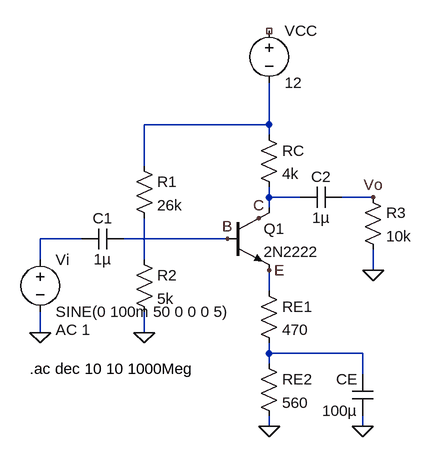
[diagram p0: schematic Draft1.asc]
Draft1.asc, the LTspice schematic file:
Version 4
SHEET 1 880 740
WIRE 352 -32 352 -96
WIRE 352 -32 160 -32
WIRE 352 -16 352 -32
WIRE 160 32 160 -32
WIRE 352 80 352 64
WIRE 400 80 352 80
WIRE 512 80 464 80
WIRE 352 96 352 80
WIRE 64 144 0 144
WIRE 288 144 128 144
WIRE 0 176 0 144
WIRE 160 176 160 112
WIRE 512 192 512 160
WIRE 352 224 352 192
WIRE 0 288 0 256
WIRE 160 288 160 256
WIRE 352 320 352 304
WIRE 496 320 352 320
WIRE 352 336 352 320
WIRE 496 352 496 320
WIRE 352 432 352 416
WIRE 496 432 496 416
FLAG 0 288 0
FLAG 160 288 0
FLAG 352 432 0
FLAG 496 432 0
FLAG 512 192 0
FLAG 512 80 Vo
FLAG 288 144 B
FLAG 352 192 E
FLAG 336 112 C
SYMBOL cap 128 128 R90
WINDOW 0 0 32 VBottom 2
WINDOW 3 32 32 VTop 2
SYMATTR InstName C1
SYMATTR Value 1µ
SYMBOL res 144 16 R0
SYMATTR InstName R1
SYMATTR Value 26k
SYMBOL res 144 160 R0
SYMATTR InstName R2
SYMATTR Value 5k
SYMBOL voltage 0 160 R0
WINDOW 123 24 124 Left 2
WINDOW 39 0 0 Left 0
SYMATTR InstName Vi
SYMATTR Value SINE(0 100m 50 0 0 0 5)
SYMATTR Value2 AC 1
SYMBOL npn 288 96 R0
SYMATTR InstName Q1
SYMATTR Value 2N2222
SYMBOL res 336 -32 R0
SYMATTR InstName RC
SYMATTR Value 4k
SYMBOL res 336 320 R0
SYMATTR InstName RE2
SYMATTR Value 560
SYMBOL cap 464 64 R90
WINDOW 0 0 32 VBottom 2
WINDOW 3 32 32 VTop 2
SYMATTR InstName C2
SYMATTR Value 1µ
SYMBOL cap 512 416 R180
WINDOW 0 24 56 Left 2
WINDOW 3 24 8 Left 2
SYMATTR InstName CE
SYMATTR Value 100µ
SYMBOL res 336 208 R0
SYMATTR InstName RE1
SYMATTR Value 470
SYMBOL res 496 64 R0
SYMATTR InstName R3
SYMATTR Value 10k
SYMBOL voltage 352 -192 R0
SYMATTR InstName VCC
SYMATTR Value 12
TEXT -16 344 Left 2 !.ac dec 10 10 1000Meg

The netlist it stands for:
* Draft1.asc
C1 B N003 1µ
R1 N001 N004 26k
R2 N004 0 5k
Vi N003 0 SINE(0 100m 50 0 0 0 5) AC 1
Q1 N002 B E 0 2N2222
RC N001 N002 4k
RE2 N005 0 560
C2 Vo N002 1µ
CE 0 N005 100µ
RE1 E N005 470
R3 Vo 0 10k
VCC NC_01 N001 12
.model NPN NPN
.model PNP PNP
.lib standard.bjt
.ac dec 10 10 1000Meg
.backanno
.end

* Results of the author's LTspice run, read from the files saved beside the schematic
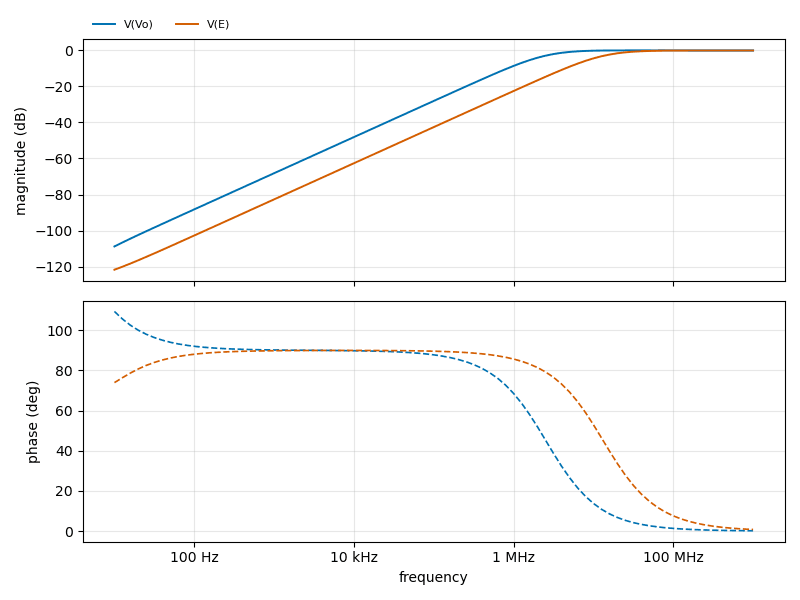
[diagram p1: AC Analysis of Draft1.asc, plotted from the saved traces]
* AC Analysis, 1 run:
*   V(Vo): -108.67 dB at 10 Hz, -0.19 dB at 1 GHz, peak -0.19 dB at 50.12 MHz, 3 dB below the peak at 2.46 MHz
*   V(E): -121.55 dB at 10 Hz, -0.20 dB at 1 GHz, peak -0.20 dB at 1 GHz, 3 dB below the peak at 13.32 MHz